# Altium schematic sheet Supply.SchDoc: Supply
size A4; Author: Tomás Valencia; DrawnBy: Tomás Valencia; DocumentNumber: 5; SheetNumber: 5; SheetTotal: 6
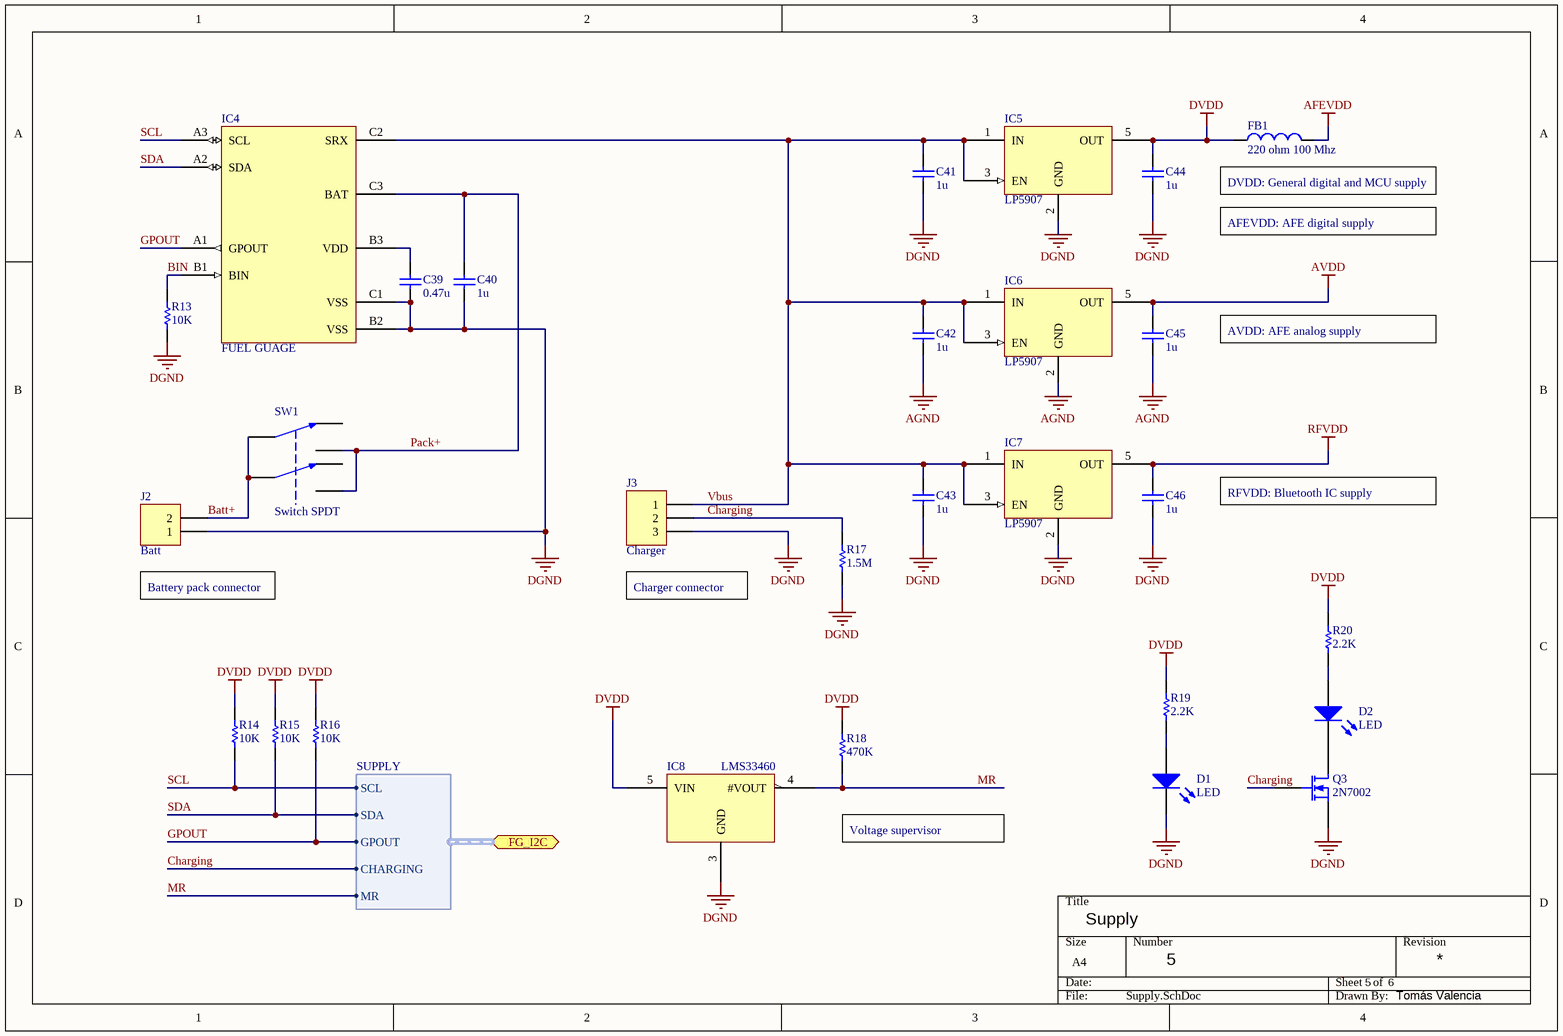
[diagram p0: Supply.SchDoc]

## Parts
C39  0.47u  [C0603]
C40  1u  [C0603]
C41  1u  [C0603]
C42  1u  [C0603]
C43  1u  [C0603]
C44  1u  [C0603]
C45  1u  [C0603]
C46  1u  [C0603]
D1  LED  [LED3015M]
D2  LED  [LED3015M]
FB1  220 ohm 100 Mhz  [0805 Ind]
IC4  FUEL GUAGE  [BQ27421]
IC5  LP5907  [SOT23]
IC6  LP5907  [SOT23]
IC7  LP5907  [SOT23]
IC8  LMS33460  [LMS33460]
J2  Batt  [JST PH 2 Socket]
J3  Charger  [JST PH 3 Socket]
Q3  2N7002  [SOT65P210X110-3N]
R13  10K  [R0603]
R14  10K  [R0603]
R15  10K  [R0603]
R16  10K  [R0603]
R17  1.5M  [R0603]
R18  470K  [R0603]
R19  2.2K  [R0603]
R20  2.2K  [R0603]
SW1  Switch SPDT  [MFS201N-16-Z]

## Ports
FG_I2C (harness SUPPLY)

## Harnesses
SUPPLY: SDA, SCL, GPOUT, CHARGING, MR

## Nets
AFEVDD: FB1.2
AGND: C42.1 C45.1 IC6.2(GND)
AVDD: C45.2 IC6.5(OUT)
DGND: C39.1 C40.1 C41.1 C43.1 C44.1 C46.1 D1.2(K) IC4.B2(VSS) IC4.C1(VSS) IC5.2(GND) IC7.2(GND) IC8.3(GND) J2.1 J3.3 Q3.2(S) R13.1 R17.1
DVDD: C44.2 FB1.1 IC5.5(OUT) IC8.5(VIN) R14.2 R15.2 R16.2 R18.2 R19.2 R20.2
RFVDD: C46.2 IC7.5(OUT)
Batt+: J2.2 SW1.2 SW1.5
BIN: IC4.B1(BIN) R13.2
Charging: J3.2 Q3.1(G) R17.2 ; port FG_I2C.CHARGING
GPOUT: IC4.A1(GPOUT) R16.1 ; port FG_I2C.GPOUT
MR: IC8.4(#VOUT) R18.1 ; port FG_I2C.MR
Pack+: C40.2 IC4.C3(BAT) SW1.3 SW1.6
SCL: IC4.A3(SCL) R14.1 ; port FG_I2C.SCL
SDA: IC4.A2(SDA) R15.1 ; port FG_I2C.SDA
Vbus: C41.2 C42.2 C43.2 IC4.C2(SRX) IC5.1(IN) IC5.3(EN) IC6.1(IN) IC6.3(EN) IC7.1(IN) IC7.3(EN) J3.1
NetC39_2: C39.2 IC4.B3(VDD)
NetD1_1: D1.1(A) R19.1
NetD2_1: D2.1(A) R20.1
NetD2_2: D2.2(K) Q3.3(D)

Not connected (* = marked no-connect by the designer): SW1 1 4

## Notes on the sheet
- (near FB1) DVDD: General digital and MCU supply
- AFEVDD: AFE digital supply
- AVDD: AFE analog supply
- RFVDD: Bluetooth IC supply
- (near J2) Battery pack connector
- (near J3) Charger connector
- Voltage supervisor

## Library data of the parts
C39 C42 C43 C45 C46 = Capacitor: Value: 100p; Rated Voltage: *
C40 C41 C44 = Capacitor: Value: 1u; Rated Voltage: *
FB1 = Ferrita: INDUCTOR, 0.04OHM, 3A, 0805; Value: 220 ohm 100 Mhz
IC4 = BQ27421: Supplier 1: Digi-Key; Supplier Part Number 1: 296-38880-1-ND
J2 = JST PH 2 Pin Socket: Supplier 1: Digi-Key; Supplier Part Number 1: 455-1719-ND
J3 = JST PH 3 Pin Socket: Supplier 1: Digi-Key; Supplier Part Number 1: 455-1720-ND
Q3 = 2N7002: Transistor, MOSFET, N-Channel, 60V, 300mA
R13-R20 = Resistor: Power: *
  R13-R16: Value: 10K
  R17: Value: 1.5M
  R18: Value: 470K
  R19 R20: Value: 2.2K
SW1 = MFS201N-16-Z: Supplier 1: Digi-Key; Supplier Part Number 1: 563-1558-ND
D1 D2 = LED: Supplier 1: Farnell; Supplier 2: Farnell; Supplier 3: Farnell; Supplier 4: Farnell; Supplier Part Number 1: 2426228; Supplier Part Number 2: 2426227; Supplier Part Number 3: 2426230; Supplier Part Number 4: 2426229
IC5-IC7 = LP5907: Supplier 1: Digi-Key; Supplier Part Number 1: 296-38557-1-ND
IC8 = LMS33460: Supplier 1: Digi-Key; Supplier Part Number 1: LMS33460MG/NOPBCT-ND